# Altium schematic sheet Power_USB.SchDoc: Sencore IB: Power & USB
size Letter; Organization: N Conrad; Revision: 20190822; SheetNumber: 2; SheetTotal: 3; Status: Prototype
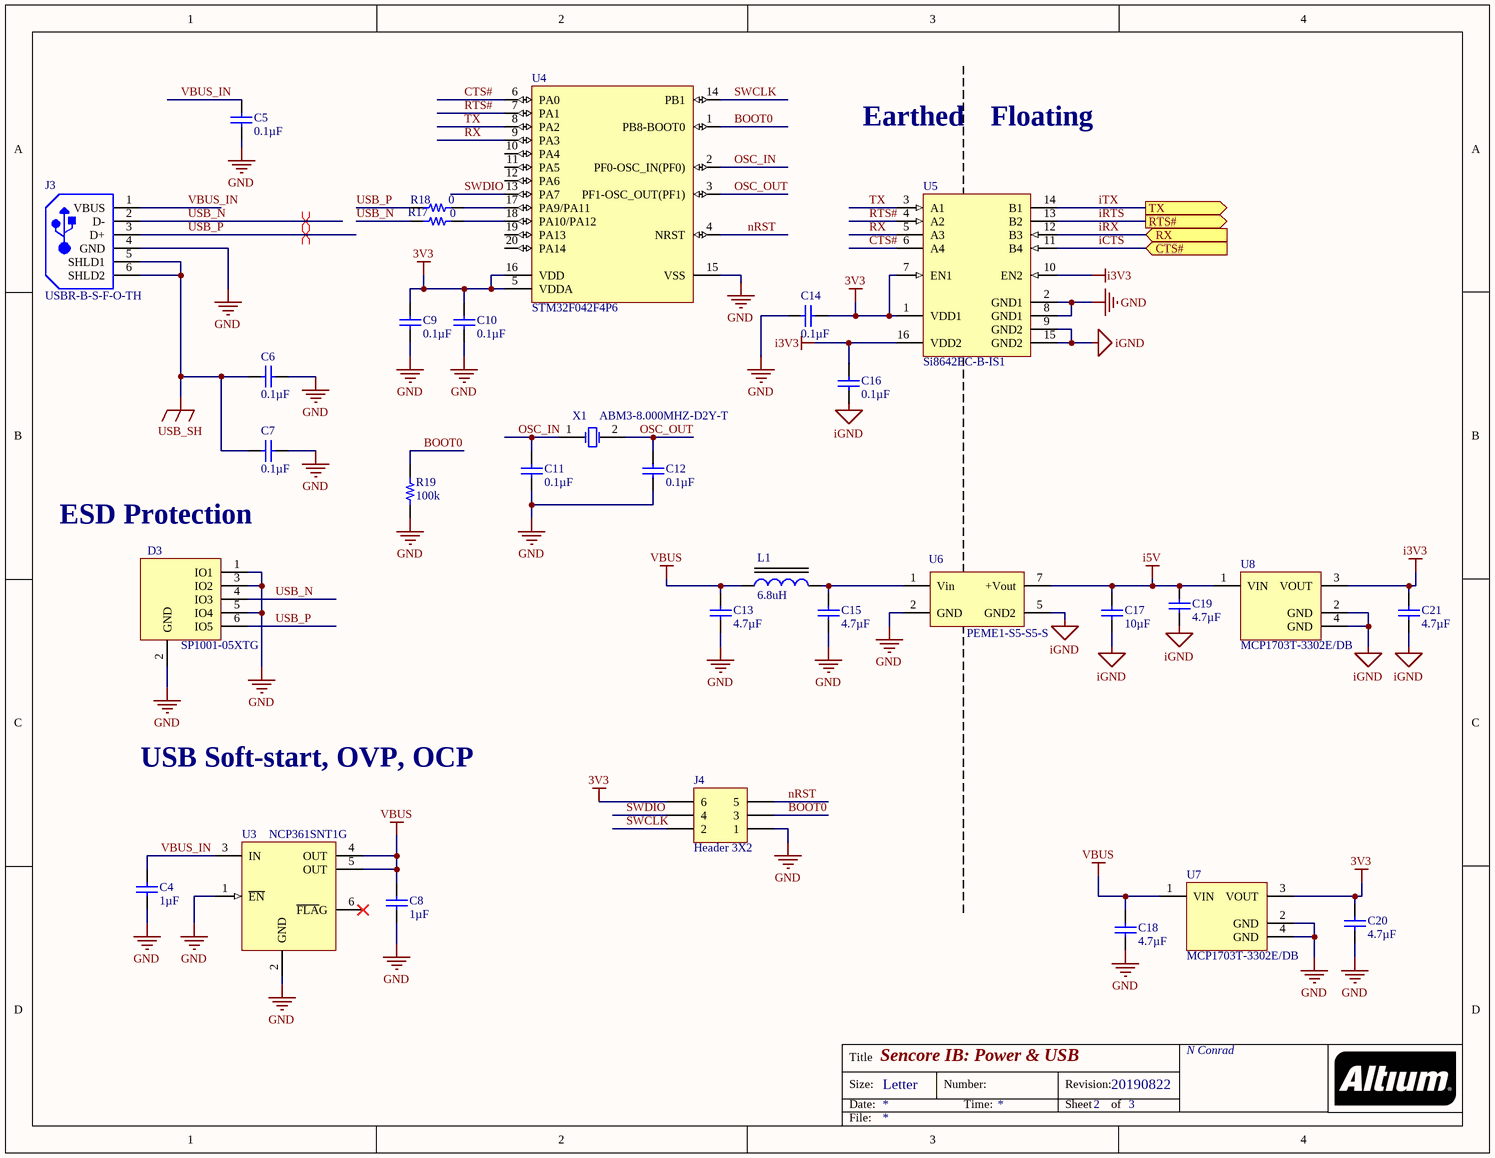
[diagram p0: Power_USB.SchDoc]

## Parts
C4  value 1µF  [CAPC1608X09L_GRM]  (hidden comment: Capacitor)
C5  value 0.1µF  [CAPC1608X09L_GRM]  (hidden comment: Capacitor)
C6  value 0.1µF  [CAPC1608X09L_GRM]  (hidden comment: Capacitor)
C7  value 0.1µF  [CAPC1608X09L_GRM]  (hidden comment: Capacitor)
C8  value 1µF  [CAPC1608X09L_GRM]  (hidden comment: Capacitor)
C9  value 0.1µF  [CAPC1608X09L_GRM]  (hidden comment: Capacitor)
C10  value 0.1µF  [CAPC1608X09L_GRM]  (hidden comment: Capacitor)
C11  value 0.1µF  [CAPC1608X09L_GRM]  (hidden comment: Capacitor)
C12  value 0.1µF  [CAPC1608X09L_GRM]  (hidden comment: Capacitor)
C13  value 4.7µF  [CAPC2012X10N_Murata_GRM21B]  (hidden comment: Capacitor)
C14  value 0.1µF  [CAPC1608X09L_GRM]  (hidden comment: Capacitor)
C15  value 4.7µF  [CAPC2012X10N_Murata_GRM21B]  (hidden comment: Capacitor)
C16  value 0.1µF  [CAPC1608X09L_GRM]  (hidden comment: Capacitor)
C17  value 10µF  [CAPC2012X10N_Murata_GRM21B]  (hidden comment: Capacitor)
C18  value 4.7µF  [CAPC2012X10N_Murata_GRM21B]  (hidden comment: Capacitor)
C19  value 4.7µF  [CAPC2012X10N_Murata_GRM21B]  (hidden comment: Capacitor)
C20  value 4.7µF  [CAPC2012X10N_Murata_GRM21B]  (hidden comment: Capacitor)
C21  value 4.7µF  [CAPC2012X10N_Murata_GRM21B]  (hidden comment: Capacitor)
D3  SP1001-05XTG  [SOTFL50P160X60-6N_Littlefuse_SOT563]
J3  USBR-B-S-F-O-TH  [SMTC-USBR-TH-4_V]
J4  Header 3X2  [HDR2X3]
L1  Inductance: 6.8uH  [INDP4040X18N_TAIYO_NRS4018]  (hidden comment: NRS4018T6R8MDGJ)
R17  0  [RESC1608X06L_Yageo0603]
R18  0  [RESC1608X06L_Yageo0603]
R19  100k  [RESC1608X06L_Yageo0603]
U3  NCP361SNT1G  [SOT95P275X110-5N_ON_TSOP-5]
U4  STM32F042F4P6  [STM-TSSOP20_M]
U5  Si8642EC-B-IS1  [SLAB-SOIC-16-NB_L]
U6  PEME1-S5-S5-S  [SIP_CUI_PEME1_S]
U7  MCP1703T-3302E/DB  [SOT-223-DB3_M]
U8  MCP1703T-3302E/DB  [SOT-223-DB3_M]
X1  ABM3-8.000MHZ-D2Y-T  [ABRA-ABM3-2_V]

## Ports
CTS# (in), RTS# (out), RX (in), TX (out)

## Nets
3V3: C9.1 C10.1 C14.2 C20.2 J4.6 U4.5(VDDA) U4.16(VDD) U5.1(VDD1) U5.7(EN1) U7.3(VOUT)
GND: C4.1 C5.2 C6.1 C7.1 C8.1 C9.2 C10.2 C11.2 C12.2 C13.1 C14.1 C15.1 C18.1 C20.1 D3.1(IO1) D3.2(GND) D3.3(IO2) D3.5(IO4) J3.4(GND) J4.1 R19.2 U3.1(~{EN}) U3.2(GND) U4.15(VSS) U5.2(GND1) U5.8(GND1) U6.2(GND) U7.2(GND) U7.4(GND)
i3V3: C16.2 C21.2 U5.10(EN2) U5.16(VDD2) U8.3(VOUT)
i5V: C17.2 C19.2 U6.7(+Vout) U8.1(VIN)
iGND: C16.1 C17.1 C19.1 C21.1 U5.9(GND2) U5.15(GND2) U6.5(GND2) U8.2(GND) U8.4(GND)
USB_SH: C6.2 C7.2 J3.5(SHLD1) J3.6(SHLD2)
VBUS: C8.2 C13.2 C18.2 L1.1 U3.4(OUT) U3.5(OUT) U7.1(VIN)
BOOT0: J4.3 R19.1 U4.1(PB8-BOOT0)
CTS#: U4.6(PA0) U5.6(A4)
iCTS: U5.11(B4) ; port CTS#
iRTS: U5.13(B2) ; port RTS#
iRX: U5.12(B3) ; port RX
iTX: U5.14(B1) ; port TX
nRST: J4.5 U4.4(NRST)
OSC_IN: C11.1 U4.2(PF0-OSC_IN(PF0)) X1.1(X1)
OSC_OUT: C12.1 U4.3(PF1-OSC_OUT(PF1)) X1.2(X2)
RTS#: U4.7(PA1) U5.4(A2)
RX: U4.9(PA3) U5.5(A3)
SWCLK: J4.2 U4.14(PB1)
SWDIO: J4.4 U4.13(PA7)
TX: U4.8(PA2) U5.3(A1)
USB_N: D3.4(IO3) J3.2(D-) R17.1
USB_P: D3.6(IO5) J3.3(D+) R18.1
VBUS_IN: C4.2 C5.1 J3.1(VBUS) U3.3(IN)
NetC15_2: C15.2 L1.2 U6.1(Vin)
NetR17_2: R17.2 U4.18(PA10/PA12)
NetR18_2: R18.2 U4.17(PA9/PA11)

Not connected (* = marked no-connect by the designer): U3 6(~{FLA}G)*; U4 10(PA4) 11(PA5) 12(PA6) 19(PA13) 20(PA14)

## Layout directives
differential pair: USB_N, USB_P

## Notes on the sheet
- Earthed
- Floating
- ESD Protection
- USB Soft-start, OVP, OCP
- Title
- Size:
- Date:
- Letter
- Number:
- Time:
- Revision:
- Sheet
- of
- File:

## Library data of the parts
C4 C8 = GCM188R71E105KA64D: CAP CER 1UF 25V X7R 0603; Manufacturer 1: Murata Electronics North America; Manufacturer Lifecycle 1: Active; Factory Stock: 0; Minimum Quantity: 1; Tolerance: ±10%; Unit Price (USD): 0.31000; Part Number: GCM188R71E105KA64D; Applications: Automotive; ComponentLink1Description: Datasheet; ComponentLink1URL: https://www.murata.com/~/media/webrenewal/support/library/catalog/products/capacitor/mlcc/c03e.ashx?la=en-us; Supplier Part Number 1: 490-10673-1-ND; Image: https://media.digikey.com/Renders/Murata%20Renders/0603-(1608-Metric)-0,90mm.jpg; Manufacturer Part Number 1: GCM188R71E105KA64D; Mounting Type: Surface Mount, MLCC; Operating Temperature: -55°C ~ 125°C; Package / Case: 0603 (1608 Metric); Packaging: Cut Tape (CT); Stock 1: 188078; Ratings: AEC-Q200; Series: GCM; Size / Dimension: 0.063" L x 0.031" W (1.60mm x 0.80mm); Supplier 1: Digi-Key; Temperature Coefficient: X7R; Thickness (Max): 0.035" (0.90mm); Voltage - Rated: 25V
C5-C7 C9-C12 C14 C16 = GCJ188R71H104KA12D: CAP CER 0.1UF 50V X7R 0603; Manufacturer 1: Murata Electronics North America; Manufacturer Lifecycle 1: Active; Factory Stock: 0; Minimum Quantity: 1; Tolerance: ±10%; Unit Price (USD): 0.31000; Part Number: GCJ188R71H104KA12D; Applications: Automotive, Boardflex Sensitive; ComponentLink1Description: Datasheet; ComponentLink1URL: https://www.murata.com/~/media/webrenewal/support/library/catalog/products/capacitor/mlcc/c03e.ashx?la=en-us; Supplier Part Number 1: 490-5798-1-ND; Features: Soft Termination; Image: https://media.digikey.com/Renders/Murata%20Renders/0603%28LQG18%29.jpg; Manufacturer Part Number 1: GCJ188R71H104KA12D; Mounting Type: Surface Mount, MLCC; Operating Temperature: -55°C ~ 125°C; Package / Case: 0603 (1608 Metric); Packaging: Cut Tape (CT); Stock 1: 2693341; Ratings: AEC-Q200; Series: GCJ; Size / Dimension: 0.063" L x 0.031" W (1.60mm x 0.80mm); Supplier 1: Digi-Key; Temperature Coefficient: X7R; Thickness (Max): 0.035" (0.90mm); Voltage - Rated: 50V
C13 C15 C18-C21 = GCM21BC71E475KE36L: CAP CER 4.7UF 25V X7S 0805; Manufacturer 1: Murata Electronics North America; Manufacturer Lifecycle 1: Active; Factory Stock: 0; Minimum Quantity: 1; Tolerance: ±10%; Unit Price (USD): 0.49000; Part Number: GCM21BC71E475KE36L; Applications: Automotive; ComponentLink1Description: Datasheet; ComponentLink1URL: https://search.murata.co.jp/Ceramy/image/img/A01X/G101/ENG/GCM21BC71E475KE36-01.pdf; Supplier Part Number 1: 490-14435-1-ND; Image: https://media.digikey.com/Renders/Murata%20Renders/0805-(2012-Metric)-1,45mm.jpg; Manufacturer Part Number 1: GCM21BC71E475KE36L; Mounting Type: Surface Mount, MLCC; Operating Temperature: -55°C ~ 125°C; Package / Case: 0805 (2012 Metric); Packaging: Cut Tape (CT); Stock 1: 283; Ratings: AEC-Q200; Series: GCM; Size / Dimension: 0.079" L x 0.049" W (2.00mm x 1.25mm); Supplier 1: Digi-Key; Temperature Coefficient: X7S; Thickness (Max): 0.057" (1.45mm); Voltage - Rated: 25V
C17 = GCM21BR71A106KE22K: CAP CER 10UF 10V X7R 0805; Manufacturer 1: Murata Electronics North America; Manufacturer Lifecycle 1: Active; Factory Stock: 0; Minimum Quantity: 1; Tolerance: ±10%; Unit Price (USD): 0.62000; Part Number: GCM21BR71A106KE22K; Applications: Automotive; ComponentLink1Description: Datasheet; ComponentLink1URL: https://search.murata.co.jp/Ceramy/image/img/A01X/G101/ENG/GCM21BR71A106KE22-01.pdf; Supplier Part Number 1: 490-14531-1-ND; Image: https://media.digikey.com/Renders/Murata%20Renders/0805-(2012-Metric)-1,40mm.jpg; Manufacturer Part Number 1: GCM21BR71A106KE22K; Mounting Type: Surface Mount, MLCC; Operating Temperature: -55°C ~ 125°C; Package / Case: 0805 (2012 Metric); Packaging: Cut Tape (CT); Stock 1: 0; Ratings: AEC-Q200; Series: GCM; Size / Dimension: 0.079" L x 0.049" W (2.00mm x 1.25mm); Supplier 1: Digi-Key; Temperature Coefficient: X7R; Thickness (Max): 0.055" (1.40mm); Voltage - Rated: 10V
D3 = SP1001-05XTG: TVS DIODE 5.5VWM 13VC SOT563; Manufacturer: Littelfuse; Direction: Unidirectional; Capacitance: 12pF; Operating Supply Voltage: 5.5V; Max Surge Current: 2A; Number of Unidirectional Channels: 5; Min Breakdown Voltage: 7V; Clamping Voltage: 13V; Power Line Protection: No; Leakage Current: 500nA; Supplier 1: Digi-Key; Supplier Part Number 1: F2898CT-ND; Stock 1: 21783; Pricing 1: 1=0.60000, 10=0.52700, 25=0.49480, 100=0.40390, 250=0.37516, 500=0.31930, 1000=0.25544 (USD); RoHS: Yes; Mount: Surface Mount; Case/Package: SOT-563; Number of Pins: 6; Min Operating Temperature: -40°C; Max Operating Temperature: 85°C; Package Quantity: 3000; Packaging: Tape and Reel; Reverse Standoff Voltage: 5.5V; Polarity: Unidirectional; Number of Channels: 5; Breakdown Voltage: 5.5V; Termination: SMD/SMT; Working Voltage: 5.5V; Number of Elements: 5; Peak Pulse Current: 2A; Composition: Zener; Length: 1.7mm; Depth: 1.3mm; Radiation Hardening: No; REACH SVHC: No SVHC; Lead Free: Lead Free; ComponentLink1URL: https://datasheet.ciiva.com/26935/getdatasheetpartid-476468-26935914.pdf?src-supplier=Verical; ComponentLink1Description: https://datasheet.ciiva.com/26935/getdatasheetpartid-476468-26935914.pdf?src-supplier=Verical; ComponentLink2URL: https://datasheet.ciiva.com/331/littelfuse-tvs-diode-array-sp1001-datasheet-pdf-331875.pdf?src-supplier=Digi-Key; ComponentLink2Description: https://datasheet.ciiva.com/331/littelfuse-tvs-diode-array-sp1001-datasheet-pdf-331875.pdf?src-supplier=Digi-Key; ComponentLink3URL: https://datasheet.ciiva.com/46428/littelfuse-spa-sp1001-0x-46428677.pdf?src-supplier=Element14; ComponentLink3Description: https://datasheet.ciiva.com/46428/littelfuse-spa-sp1001-0x-46428677.pdf?src-supplier=Element14; ComponentLink4URL: https://datasheet.ciiva.com/22637/685841-22637994.pdf?src-supplier=Element14; ComponentLink4Description: https://datasheet.ciiva.com/22637/685841-22637994.pdf?src-supplier=Element14; ComponentLink5URL: https://datasheet.ciiva.com/1219/685841-1219791.pdf?src-supplier=Newark; ComponentLink5Description: https://datasheet.ciiva.com/1219/685841-1219791.pdf?src-supplier=Newark; ComponentLink6URL: https://datasheet.ciiva.com/331/littelfuse-tvs-diode-array-sp1001-datasheet-pdf-331874.pdf?src-supplier=Digi-Key; ComponentLink6Description: https://datasheet.ciiva.com/331/littelfuse-tvs-diode-array-sp1001-datasheet-pdf-331874.pdf?src-supplier=Digi-Key; ComponentLink7URL: https://datasheet.ciiva.com/331/littelfuse-tvs-diode-array-sp1001-datasheet-pdf-331876.pdf?src-supplier=Digi-Key; ComponentLink7Description: https://datasheet.ciiva.com/331/littelfuse-tvs-diode-array-sp1001-datasheet-pdf-331876.pdf?src-supplier=Digi-Key; Manufacturer Part Number: SP1001-05XTG
J3 = USBR-B-S-F-O-TH: Conn USB F 4 POS 2.5mm Solder RA Thru-Hole 4 Terminal 1 Port Tray; Manufacturer 1: Samtec; Number of Contacts: 4; Gender: Female; Number of Ports: 1; Max Voltage Rating (AC): 30V; Pitch: 2.5mm; Packaging: Tray; Supplier 1: Digi-Key; Supplier Part Number 1: SAM10873-ND; Stock 1: 3706; Pricing 1: 1=1.18000, 10=1.03500, 25=0.97440, 50=0.93380, 100=0.89320, 250=0.81200, 500=0.73080, 1000=0.64960, 2500=0.58870 (USD); RoHS: Yes; Mount: Through Hole; Contact Material: Bronze; Contact Plating: Gold; Number of Terminals: 4; Housing Material: Thermoplastic; Min Operating Temperature: -50°C; Max Operating Temperature: 85°C; Termination: Solder; Orientation: Right Angle; Length: 14.9mm; Depth: 16.5mm; Radiation Hardening: No; ComponentLink1URL: https://datasheet.ciiva.com/26826/getdatasheetpartid-319341-26826517.pdf?src-supplier=Verical; ComponentLink1Description: https://datasheet.ciiva.com/26826/getdatasheetpartid-319341-26826517.pdf?src-supplier=Verical; ComponentLink2URL: https://datasheet.ciiva.com/3095/usb-b-3095519.pdf?src-supplier=Avnet; ComponentLink2Description: https://datasheet.ciiva.com/3095/usb-b-3095519.pdf?src-supplier=Avnet; Manufacturer Part Number 1: USBR-B-S-F-O-TH
J4 = Header 3X2: Header, 3-Pin, Dual row; LatestRevisionDate: 17-Jul-2002; LatestRevisionNote: Re-released for DXP Platform.; Publisher: Altium Limited
L1 = NRS4018T6R8MDGJ: FIXED IND 6.8UH 1.45A 117.6 MOHM; Manufacturer: Taiyo Yuden; Core Material: Ferrite; Tolerance: 20%; Self Resonant Frequency: 30MHz; Saturation Current: 1.6A; Shielding: Shielded; DC Resistance (DCR): 117.6mR; Test Frequency: 100kHz; Supplier 1: Digi-Key; Supplier Part Number 1: 587-2894-1-ND; Stock 1: 26350; Pricing 1: 1=0.29000, 10=0.26100, 100=0.17930, 500=0.15324, 1000=0.11738 (USD); RoHS: Yes; Mount: Surface Mount; Case/Package: Nonstandard; Min Operating Temperature: -25°C; Max Operating Temperature: 125°C; Packaging: Tape and Reel; Current Rating: 1.45A; Composition: Wirewound; Inductance Tolerance: 20%; Package Quantity: 3500; Max DC Current: 1.6A; Termination: SMD/SMT; RMS Current (Irms): 1.45A; Length: 4mm; Height: 1.8mm; Width: 4mm; Height - Seated (Max): 0.071inch; Depth: 4.2mm; Lead Pitch: 2.8mm; Radiation Hardening: No; REACH SVHC: Unknown; Halogen Free: Halogen Free; ComponentLink1URL: https://datasheet.ciiva.com/7397/nrs4018t6r8mdgj-ss-7397809.pdf?src-supplier=Newark; ComponentLink1Description: https://datasheet.ciiva.com/7397/nrs4018t6r8mdgj-ss-7397809.pdf?src-supplier=Newark; ComponentLink2URL: https://datasheet.ciiva.com/8504/nrs4018t6r8mdgj-ss-8504338.pdf?src-supplier=Avnet; ComponentLink2Description: https://datasheet.ciiva.com/8504/nrs4018t6r8mdgj-ss-8504338.pdf?src-supplier=Avnet; ComponentLink3URL: https://datasheet.ciiva.com/25607/0900766b810b3cd2-25607946.pdf?src-supplier=RSComponents; ComponentLink3Description: https://datasheet.ciiva.com/25607/0900766b810b3cd2-25607946.pdf?src-supplier=RSComponents; ComponentLink4URL: https://datasheet.ciiva.com/4960/wound04-e-4960362.pdf?src-supplier=Mouser; ComponentLink4Description: https://datasheet.ciiva.com/4960/wound04-e-4960362.pdf?src-supplier=Mouser; Manufacturer Part Number: NRS4018T6R8MDGJ
R17 R18 = RC0603JR-070RL: RES SMD 0 OHM JUMPER 1/10W 0603; Manufacturer 1: Yageo; Manufacturer Lifecycle 1: Active; Minimum Quantity: 1; Power (Watts): 0.1W, 1/10W; Unit Price (USD): 0.10000; Value: 0; Part Number: RC0603JR-070RL; ComponentLink1Description: Datasheet; Composition: Thick Film; ComponentLink1URL: http://www.yageo.com/documents/recent/PYu-RC_Group_51_RoHS_L_9.pdf; Supplier Part Number 1: 311-0.0GRCT-ND; Factory Stock: 0; Features: Moisture Resistant; Height - Seated (Max): 0.022" (0.55mm); Image: https://media.digikey.com/Renders/Yageo%20Renders/0603-(1608-Metric).jpg; Manufacturer Part Number 1: RC0603JR-070RL; Number of Terminations: 2; Operating Temperature: -55°C ~ 155°C; Package / Case: 0603 (1608 Metric); Packaging: Cut Tape (CT); Stock 1: 0; Series: RC; Size / Dimension: 0.063" L x 0.032" W (1.60mm x 0.80mm); Supplier 1: Digi-Key; Supplier Device Package: 0603; Tolerance: Jumper
R19 = RC0603JR-07100KL: RES SMD 100K OHM 5% 1/10W 0603; Manufacturer 1: Yageo; Manufacturer Lifecycle 1: Active; Factory Stock: 0; Minimum Quantity: 1; Power (Watts): 0.1W, 1/10W; Temperature Coefficient: ±100ppm/°C; Unit Price (USD): 0.10000; Value: 100k; Part Number: RC0603JR-07100KL; ComponentLink1Description: Datasheet; Composition: Thick Film; ComponentLink1URL: http://www.yageo.com/documents/recent/PYu-RC_Group_51_RoHS_L_9.pdf; Supplier Part Number 1: 311-100KGRCT-ND; Features: Moisture Resistant; Height - Seated (Max): 0.022" (0.55mm); Image: https://media.digikey.com/Renders/Yageo%20Renders/0603-(1608-Metric).jpg; Manufacturer Part Number 1: RC0603JR-07100KL; Number of Terminations: 2; Operating Temperature: -55°C ~ 155°C; Package / Case: 0603 (1608 Metric); Packaging: Cut Tape (CT); Stock 1: 0; Series: RC; Size / Dimension: 0.063" L x 0.032" W (1.60mm x 0.80mm); Supplier 1: Digi-Key; Supplier Device Package: 0603; Tolerance: ±5%
U3 = NCP361SNT1G: IC USB POS OVP/OCP 5TSOP; Manufacturer: ON Semiconductor; Min Supply Voltage: 1.2V; Max Supply Voltage: 20V; Number of Circuits: 1; Overvoltage Threshold: 5.675V; Undervoltage Threshold: 3V; Watchdog Timer: No; Max Reset Threshold Voltage: 5.9V; Min Reset Threshold Voltage: 5.43V; Nominal Supply Current: 20uA; Supplier 1: Digi-Key; Supplier Part Number 1: NCP361SNT1GOSCT-ND; Stock 1: 10650; Pricing 1: 1=0.73000, 10=0.64200, 100=0.49250, 500=0.38934, 1000=0.31147 (USD); RoHS: Yes; Mount: Surface Mount; Case/Package: TSOP; Number of Pins: 5; Min Operating Temperature: -40°C; Max Operating Temperature: 85°C; Package Quantity: 3000; Packaging: Tape and Reel; Working Voltage: 20V; Number of Voltages Monitored: 1; Threshold Voltage: 3V; Type: Voltage Detector; Length: 3mm; Height: 1mm; Width: 1.5mm; Radiation Hardening: No; REACH SVHC: No SVHC; Lead Free: Lead Free; Halogen Free: Halogen Free; ComponentLink1URL: https://datasheet.ciiva.com/361/ncp361-d-361701.pdf?src-supplier=Digi-Key; ComponentLink1Description: https://datasheet.ciiva.com/361/ncp361-d-361701.pdf?src-supplier=Digi-Key; ComponentLink2URL: https://datasheet.ciiva.com/4900/ncp361-d-60033-4900923.pdf?src-supplier=Mouser; ComponentLink2Description: https://datasheet.ciiva.com/4900/ncp361-d-60033-4900923.pdf?src-supplier=Mouser; ComponentLink3URL: https://datasheet.ciiva.com/361/ncp361-d-361702.pdf?src-supplier=Digi-Key; ComponentLink3Description: https://datasheet.ciiva.com/361/ncp361-d-361702.pdf?src-supplier=Digi-Key; ComponentLink4URL: https://datasheet.ciiva.com/15222/getdatasheetpartid-53084-15222662.pdf?src-supplier=Verical; ComponentLink4Description: https://datasheet.ciiva.com/15222/getdatasheetpartid-53084-15222662.pdf?src-supplier=Verical; ComponentLink5URL: https://datasheet.ciiva.com/361/ncp361-d-361703.pdf?src-supplier=Digi-Key; ComponentLink5Description: https://datasheet.ciiva.com/361/ncp361-d-361703.pdf?src-supplier=Digi-Key; ComponentLink6URL: https://datasheet.ciiva.com/1144/1749469-1144520.pdf?src-supplier=Newark; ComponentLink6Description: https://datasheet.ciiva.com/1144/1749469-1144520.pdf?src-supplier=Newark; ComponentLink7URL: https://datasheet.ciiva.com/1490/ncp361-d-1490522.pdf?src-supplier=Element14; ComponentLink7Description: https://datasheet.ciiva.com/1490/ncp361-d-1490522.pdf?src-supplier=Element14; ComponentLink8URL: https://datasheet.ciiva.com/28631/1749469-28631723.pdf?src-supplier=Element14; ComponentLink8Description: https://datasheet.ciiva.com/28631/1749469-28631723.pdf?src-supplier=Element14; ComponentLink9URL: https://datasheet.ciiva.com/26069/ncp361-d-26069158.pdf?src-supplier=Avnet+Europe; ComponentLink9Description: https://datasheet.ciiva.com/26069/ncp361-d-26069158.pdf?src-supplier=Avnet+Europe; ComponentLink10URL: https://datasheet.ciiva.com/16469/ncp361-d-16469656.pdf?src-supplier=Future+Electronics; ComponentLink10Description: https://datasheet.ciiva.com/16469/ncp361-d-16469656.pdf?src-supplier=Future+Electronics; ComponentLink11URL: https://datasheet.ciiva.com/8142/ncp361-d-8142766.pdf?src-supplier=Avnet; ComponentLink11Description: https://datasheet.ciiva.com/8142/ncp361-d-8142766.pdf?src-supplier=Avnet; ComponentLink12URL: https://datasheet.ciiva.com/8142/ncp361-d-8142767.pdf?src-supplier=Avnet; ComponentLink12Description: https://datasheet.ciiva.com/8142/ncp361-d-8142767.pdf?src-supplier=Avnet; Manufacturer Part Number: NCP361SNT1G
U4 = CMP-0304-00106-2: ARM Cortex-M0 32-bit MCU, 16 KB Flash, 6 KB Internal RAM, 16 I/Os, 20-Pin TSSOP, -40 to 85 degC, Tray; Manufacturer: STMicroelectronics; Supply Voltage(Vcc) min (V): 2; Operating Frequency(F) (Processor speed) (MHz): 48; Internal RAM Size (kB): 6; FLASH Size (Prog) (kB): 16; PartNumber: STM32F042F4P6; DatasheetVersion: Rev. 5; Package Reference: TSSOP20; Packing: Tray; ComponentLink2URL: http://www.st.com/st-web-ui/static/active/en/resource/technical/document/datasheet/DM00105814.pdf; Core: ARM Cortex-M0; ComponentLink2Description: Datasheet; ComponentLink1URL: http://www.st.com/; Package Description: 20-Pin Thin Shrink Small Outline Package, Body 6.5 x 4.4 mm, Pitch 0.65 mm; Mounting Technology: Surface Mount; ComponentLink1Description: Manufacturer URL; I/Os (High Current): 16
U5 = CMP-0512-00193-1: Low-Power Quad-Channel Digital Isolator, 150 Mbps, 3.75 kVRMS Isolation Rating, -40 to 125 degC, 16-pin SOIC; Manufacturer: Silicon Labs; Maximum Propagation Delay (ns): 13; Isolation Rating (kV): 3.75; Maximum Data Rate (Mbps): 150; Channel Type: Unidirectional; 10kV surge: FALSE; AEC-Q100: TRUE; Sub-Family: Isolators; DatasheetVersion: Rev. 1.5; ComponentLink2URL: http://www.silabs.com/Support%20Documents/TechnicalDocs/Si864x.pdf; ComponentLink2Description: Datasheet; ComponentLink3Description: Package Specification; ComponentLink1Description: Manufacturer URL; Code_IPC: J-STD-020; Code_JEDEC: MS-012; Mounting Technology: Surface Mount; ComponentLink3URL: http://www.silabs.com/Support%20Documents/TechnicalDocs/si2401.pdf; PackageDescription: 16-Pin Small-Outline Integrated Circuit, Body 9.9 x 3.9 mm, Pitch 1.27 mm; PackageReference: SOIC-16-NB; PartNumber: Si8642EC-B-IS1; Enable Control: TRUE; ComponentLink1URL: http://www.silabs.com/
U6 = PEME1-S5-S5-S: 5 Vdc, 0.2 A, 1 W, 4.5 ~ 5.5 Vdc Input Range; Manufacturer: CUI; Core Material: Ferrite; Tolerance: 20%; Self Resonant Frequency: 30MHz; Inductance: 6.8uH; Current Rating: 1.45A; Saturation Current: 1.6A; Shielding: Shielded; DC Resistance (DCR): 117.6mR; Test Frequency: 100kHz; Supplier 1: Digi-Key; Supplier Part Number 1: 102-6337-ND; Stock 1: 22; Pricing 1: 1=2.29000, 5=2.26000, 10=2.22700, 25=2.16160, 50=2.09600, 100=2.03050, 250=1.96500, 500=1.83400 (USD); ComponentLink1URL: http://datasheet.octopart.com/PEME1-S5-S5-S-CUI-datasheet-136090884.pdf?src-supplier=CUI; ComponentLink1Description: http://datasheet.octopart.com/PEME1-S5-S5-S-CUI-datasheet-136090884.pdf?src-supplier=CUI; RoHS: Yes; Mount: Surface Mount; Case/Package: Nonstandard; Min Operating Temperature: -25°C; Max Operating Temperature: 125°C; Packaging: Tape and Reel; Composition: Wirewound; Inductance Tolerance: 20%; Package Quantity: 3500; Max DC Current: 1.6A; Termination: SMD/SMT; RMS Current (Irms): 1.45A; Length: 4mm; Height: 1.8mm; Width: 4mm; Height - Seated (Max): 0.071inch; Depth: 4.2mm; Lead Pitch: 2.8mm; Radiation Hardening: No; REACH SVHC: Unknown; Halogen Free: Halogen Free; ComponentLink2URL: https://datasheet.ciiva.com/7397/nrs4018t6r8mdgj-ss-7397809.pdf?src-supplier=Newark; ComponentLink2Description: https://datasheet.ciiva.com/7397/nrs4018t6r8mdgj-ss-7397809.pdf?src-supplier=Newark; ComponentLink3URL: https://datasheet.ciiva.com/8504/nrs4018t6r8mdgj-ss-8504338.pdf?src-supplier=Avnet; ComponentLink3Description: https://datasheet.ciiva.com/8504/nrs4018t6r8mdgj-ss-8504338.pdf?src-supplier=Avnet; ComponentLink4URL: https://datasheet.ciiva.com/25607/0900766b810b3cd2-25607946.pdf?src-supplier=RSComponents; ComponentLink4Description: https://datasheet.ciiva.com/25607/0900766b810b3cd2-25607946.pdf?src-supplier=RSComponents; ComponentLink5URL: https://datasheet.ciiva.com/4960/wound04-e-4960362.pdf?src-supplier=Mouser; ComponentLink5Description: https://datasheet.ciiva.com/4960/wound04-e-4960362.pdf?src-supplier=Mouser; Manufacturer Part Number: PEME1-S5-S5-S
U7 U8 = CMP-0136-00469-1: 250 mA, 16V, Low Quiescent Current LDO Regulator, 3-Pin SOT-223, Extended Temperature, Tape and Reel; PackageReference: SOT-223-DB3; PackageDescription: 3-Lead Plastic Small Outline Transistor (DB) [SOT-223]; PackageVersion: revBB, Aug-2009; DatasheetVersion: revD, Sep-2009
X1 = CMP-2000-05033-1: Miniature Ceramic Crystal, 8 MHz, -40 to 85 degC, 2-Pin SMD, RoHS, Tape and Reel; Manufacturer: ABRACON; Case Length: 5mm; Case Width: 3.2mm; Case Height: 1.3mm; Load Capacitance: 18pF; Frequency: 8MHz; Frequency Stability: 30PPM; ESR: 140Ohms; Tolerance: 20PPM; Type: MiniatureCeramicCrystal; Factory Pack Quantity: 1000; Package / Case: 5mmx3.2mm; Mounting Style: SMD/SMT; Manufacturer URL: http://www.abracon.com/; RoHS: Details; Dimensions: 3.2mmWx5mmLx1.3mmH; Datasheet URL: http://www.farnell.com/datasheets/1754353.pdf; Brand: ABRACON; Packaging: Reel; Product Category: Crystals; Package Description: 2-Pin Surface Mount Device, Body 5 x 3.2 mm; Package URL: http://www.abracon.com/Support/PackageDrawing/Resonators/ABM3.PDF; Operating Temperature Range: -40Cto+85C; Termination Style: SMD/SMT; Datasheet Version: Sep-13; Series: ABM3; Package Reference: ABM3-2